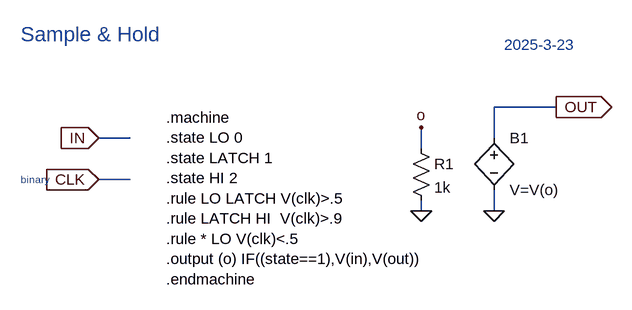
[diagram p0: schematic SAMPLEHOLD.asc]
SAMPLEHOLD.asc, the LTspice schematic file:
Version 4
SHEET 1 880 680
WIRE 576 -560 480 -560
WIRE -80 -512 -128 -512
WIRE 480 -512 480 -560
WIRE 368 -496 368 -528
WIRE -80 -448 -128 -448
WIRE 368 -400 368 -416
WIRE 480 -400 480 -432
FLAG -128 -512 IN
IOPIN -128 -512 In
FLAG -128 -448 CLK
IOPIN -128 -448 In
FLAG 576 -560 OUT
IOPIN 576 -560 Out
FLAG 368 -400 0
FLAG 368 -528 o
FLAG 480 -400 0
SYMBOL res 352 -512 R0
SYMATTR InstName R1
SYMATTR Value 1k
SYMBOL bv 480 -528 R0
SYMATTR InstName B1
SYMATTR Value V=V(o)
TEXT -248 -672 Left 3 ;Sample & Hold
TEXT -248 -448 Left 1 ;binary
TEXT 496 -656 Left 2 ;2025-3-23
TEXT -24 -544 Left 2 !.machine\n.state LO 0\n.state LATCH 1\n.state HI 2\n.rule LO LATCH V(clk)>.5\n.rule LATCH HI  V(clk)>.9\n.rule * LO V(clk)<.5\n.output (o) IF((state==1),V(in),V(out))  \n.endmachine

The netlist it stands for:
* SAMPLEHOLD.asc
R1 o 0 1k
B1 OUT 0 V=V(o)
* Sample & Hold
* binary
* 2025-3-23
.machine
.state LO 0
.state LATCH 1
.state HI 2
.rule LO LATCH V(clk)>.5
.rule LATCH HI  V(clk)>.9
.rule * LO V(clk)<.5
.output (o) IF((state==1),V(in),V(out))
.endmachine
.backanno
.end